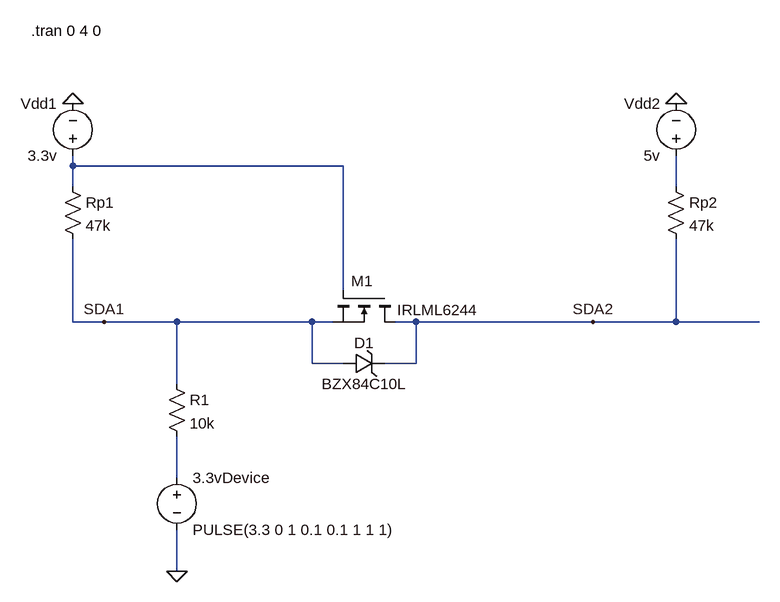
[diagram p0: schematic i2c Demo 2.asc]
i2c Demo 2.asc, the LTspice schematic file:
Version 4
SHEET 1 952 784
WIRE -112 144 -112 128
WIRE 304 144 -112 144
WIRE -112 176 -112 144
WIRE 816 176 816 128
WIRE 304 336 304 144
WIRE -112 384 -112 256
WIRE -64 384 -112 384
WIRE 48 384 -64 384
WIRE 256 384 48 384
WIRE 288 384 256 384
WIRE 416 384 384 384
WIRE 688 384 416 384
WIRE 816 384 816 256
WIRE 816 384 688 384
WIRE 944 384 816 384
WIRE 256 448 256 384
WIRE 304 448 256 448
WIRE 416 448 416 384
WIRE 416 448 368 448
WIRE 48 480 48 384
WIRE 48 624 48 560
WIRE 48 768 48 704
FLAG 48 768 0
FLAG 816 48 0
FLAG -112 48 0
FLAG 688 384 SDA2
FLAG -64 384 SDA1
SYMBOL nmos 384 336 R90
WINDOW 0 -15 34 VRight 2
WINDOW 3 30 -128 VRight 2
SYMATTR InstName M1
SYMATTR Value IRLML6244
SYMBOL voltage -112 144 R180
WINDOW 0 24 96 Left 2
WINDOW 3 24 16 Left 2
SYMATTR InstName Vdd1
SYMATTR Value 3.3v
SYMBOL voltage 816 144 R180
WINDOW 0 24 96 Left 2
WINDOW 3 24 16 Left 2
SYMATTR InstName Vdd2
SYMATTR Value 5v
SYMBOL res -128 160 R0
SYMATTR InstName Rp1
SYMATTR Value 47k
SYMBOL res 800 160 R0
SYMATTR InstName Rp2
SYMATTR Value 47k
SYMBOL voltage 48 608 R0
SYMATTR InstName 3.3vDevice
SYMATTR Value PULSE(3.3 0 1 0.1 0.1 1 1 1)
SYMBOL zener 304 464 R270
WINDOW 0 32 32 VTop 2
WINDOW 3 0 32 VBottom 2
SYMATTR InstName D1
SYMATTR Value BZX84C10L
SYMATTR Description Diode
SYMATTR Type diode
SYMBOL res 32 464 R0
SYMATTR InstName R1
SYMATTR Value 10k
TEXT -176 -64 Left 2 !.tran 0 4 0

The netlist it stands for:
* i2c Demo 2.asc
M1 SDA2 N001 SDA1 SDA1 IRLML6244
Vdd1 N001 0 3.3v
Vdd2 N002 0 5v
Rp1 N001 SDA1 47k
Rp2 N002 SDA2 47k
V§3.3vDevice N003 0 PULSE(3.3 0 1 0.1 0.1 1 1 1)
D1 SDA1 SDA2 BZX84C10L
R1 SDA1 N003 10k
.model D D
.lib standard.dio
.model NMOS NMOS
.model PMOS PMOS
.lib standard.mos
.tran 0 4 0
.backanno
.end